# Altium schematic sheet top_sheet.SchDoc
size A4; SheetNumber: 1; SheetTotal: 7
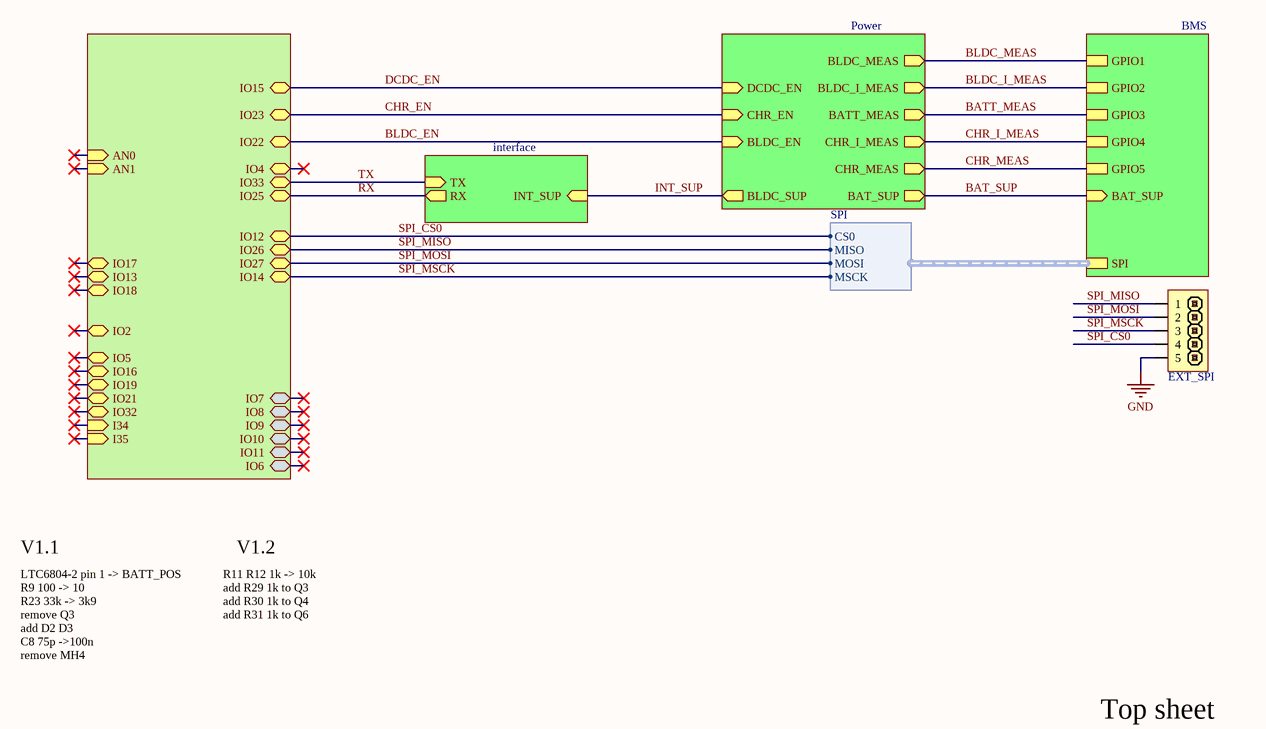
[diagram p0: top_sheet.SchDoc]

## Parts
EXT_SPI  PIN HEADER 1x5  [PIN HEADER SINGLE 5]  (value not drawn)

## Sub-sheets
BMS = LTC6804-2_BMS_TR.SchDoc: GPIO1, GPIO5, GPIO4, SPI (harness SPI), GPIO3, GPIO2, BAT_SUP (in)
interface = data_interface.SchDoc: TX (in), RX (out), INT_SUP (in)
Power = power.SchDoc: BLDC_EN (in), BLDC_I_MEAS (out), CHR_EN (in), CHR_I_MEAS (out), BLDC_MEAS (out), CHR_MEAS (out), BATT_MEAS (out), BAT_SUP (out), DCDC_EN (in), BLDC_SUP (out)
U_ESP32_WROOM2 = ESP32_WROOM2: IO25 (bidir), IO26 (bidir), IO27 (bidir), IO22 (bidir), IO23 (bidir), IO32 (bidir), IO19 (bidir), IO21 (bidir), IO33 (bidir), IO14 (bidir), IO12 (bidir), IO15 (bidir), IO16 (bidir), IO17 (bidir), IO18 (bidir), IO13 (bidir), I34 (in), I35 (in), IO5 (bidir), IO4 (bidir), IO2 (bidir), AN0 (in), AN1 (in), IO7 (bidir), IO8 (bidir), IO9 (bidir), IO10 (bidir), IO11 (bidir), IO6 (bidir)

## Harnesses
SPI: CS0, MISO, MOSI, MSCK

## Nets
GND: EXT_SPI.5
BAT_SUP: sheet BMS/BAT_SUP, sheet Power/BAT_SUP
BATT_MEAS: sheet BMS/GPIO3, sheet Power/BATT_MEAS
BLDC_EN: sheet U_ESP32_WROOM2/IO22, sheet Power/BLDC_EN
BLDC_I_MEAS: sheet BMS/GPIO2, sheet Power/BLDC_I_MEAS
BLDC_MEAS: sheet BMS/GPIO1, sheet Power/BLDC_MEAS
CHR_EN: sheet U_ESP32_WROOM2/IO23, sheet Power/CHR_EN
CHR_I_MEAS: sheet BMS/GPIO4, sheet Power/CHR_I_MEAS
CHR_MEAS: sheet BMS/GPIO5, sheet Power/CHR_MEAS
DCDC_EN: sheet U_ESP32_WROOM2/IO15, sheet Power/DCDC_EN
INT_SUP: sheet Power/BLDC_SUP, sheet interface/INT_SUP
RX: sheet U_ESP32_WROOM2/IO25, sheet interface/RX
SPI_CS0: EXT_SPI.4 ; sheet U_ESP32_WROOM2/IO12, sheet BMS/SPI.CS0
SPI_MISO: EXT_SPI.1 ; sheet U_ESP32_WROOM2/IO26, sheet BMS/SPI.MISO
SPI_MOSI: EXT_SPI.2 ; sheet U_ESP32_WROOM2/IO27, sheet BMS/SPI.MOSI
SPI_MSCK: EXT_SPI.3 ; sheet U_ESP32_WROOM2/IO14, sheet BMS/SPI.MSCK
TX: sheet U_ESP32_WROOM2/IO33, sheet interface/TX

## Notes on the sheet
- V1.1
- LTC6804-2 pin 1 -> BATT_POS
- R11 R12 1k -> 10k
- V1.2
- R9 100 -> 10
- R23 33k -> 3k9
- remove Q3
- add D2 D3
- C8 75p ->100n
- add R29 1k to Q3
- add R30 1k to Q4
- add R31 1k to Q6
- remove MH4
- Top sheet

## Library data of the parts
EXT_SPI = PIN HEADER 2.54 1x5